# EAGLE design dual power (EAGLE 9.6.2)
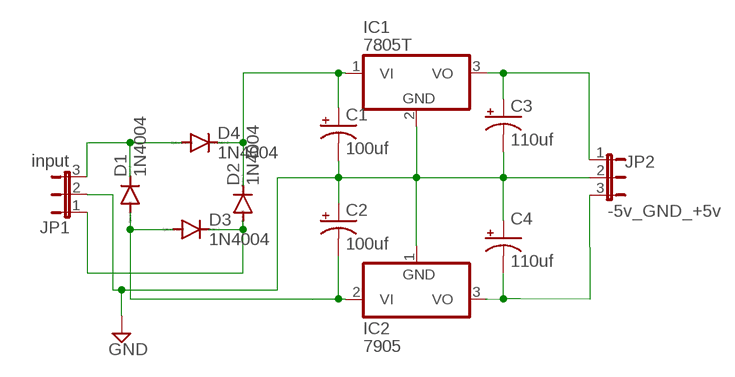
[diagram p0: schematic, sheet 1]

## Parts
C1  100uf  CPOL-US085CS-1AR  [085CS_1AR]
C2  100uf  CPOL-US085CS-1AR  [085CS_1AR]
C3  110uf  CPOL-US085CS-1AR  [085CS_1AR]
C4  110uf  CPOL-US085CS-1AR  [085CS_1AR]
D1  1N4004  [DO41-10]
D2  1N4004  [DO41-10]
D3  1N4004  [DO41-10]
D4  1N4004  [DO41-10]
IC1  7805T  [TO220H]
IC2  7905  7906T  [TO220H]
JP1  input  JP2E  [JP2]
JP2  -5v_GND_+5v  JP2E  [JP2]

## Nets
GND: C1.- C2.+ C3.- C4.+ IC1.2(GND) IC2.1(GND) JP1.2 JP2.2
N$1: D1.C D4.A JP1.3
N$2: C1.+ D2.C D4.C IC1.1(VI)
N$3: C2.- D1.A D3.A IC2.2(VI)
N$4: D2.A D3.C JP1.1
N$6: C3.+ IC1.3(VO) JP2.1
N$7: C4.- IC2.3(VO) JP2.3

## Library data of the parts
C1-C4 = rcl:CPOL-US: POLARIZED CAPACITOR, American symbol; SPICEPREFIX: C
D1-D4 = diode:1N4004: DIODE general purpose rectifier, 1 A
IC1 = linear:78*: Positive VOLTAGE REGULATOR Source: http://cache.national.com/ds/LM/LM78L05.pdf http://www.fairchildsemi.com/ds/LM/LM7805.pdf
IC2 = linear:79*: Negative VOLTAGE REGULATOR
JP1 JP2 = jumper:JP2E: JUMPER

## Board
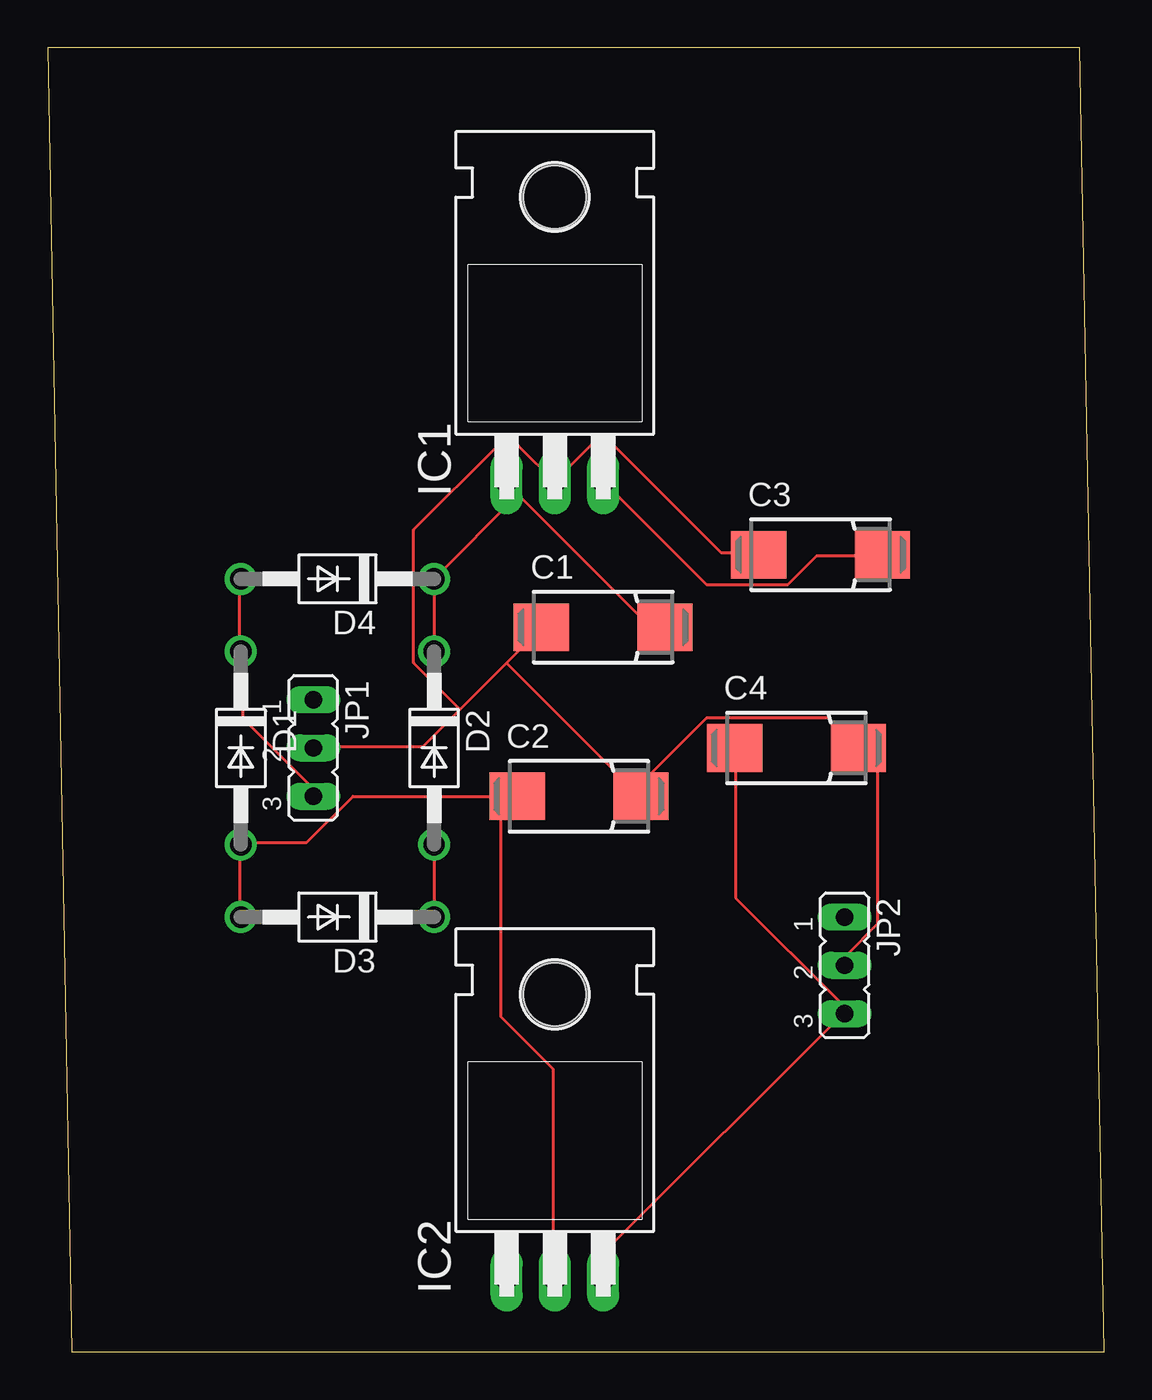
[diagram p1: board, top side]
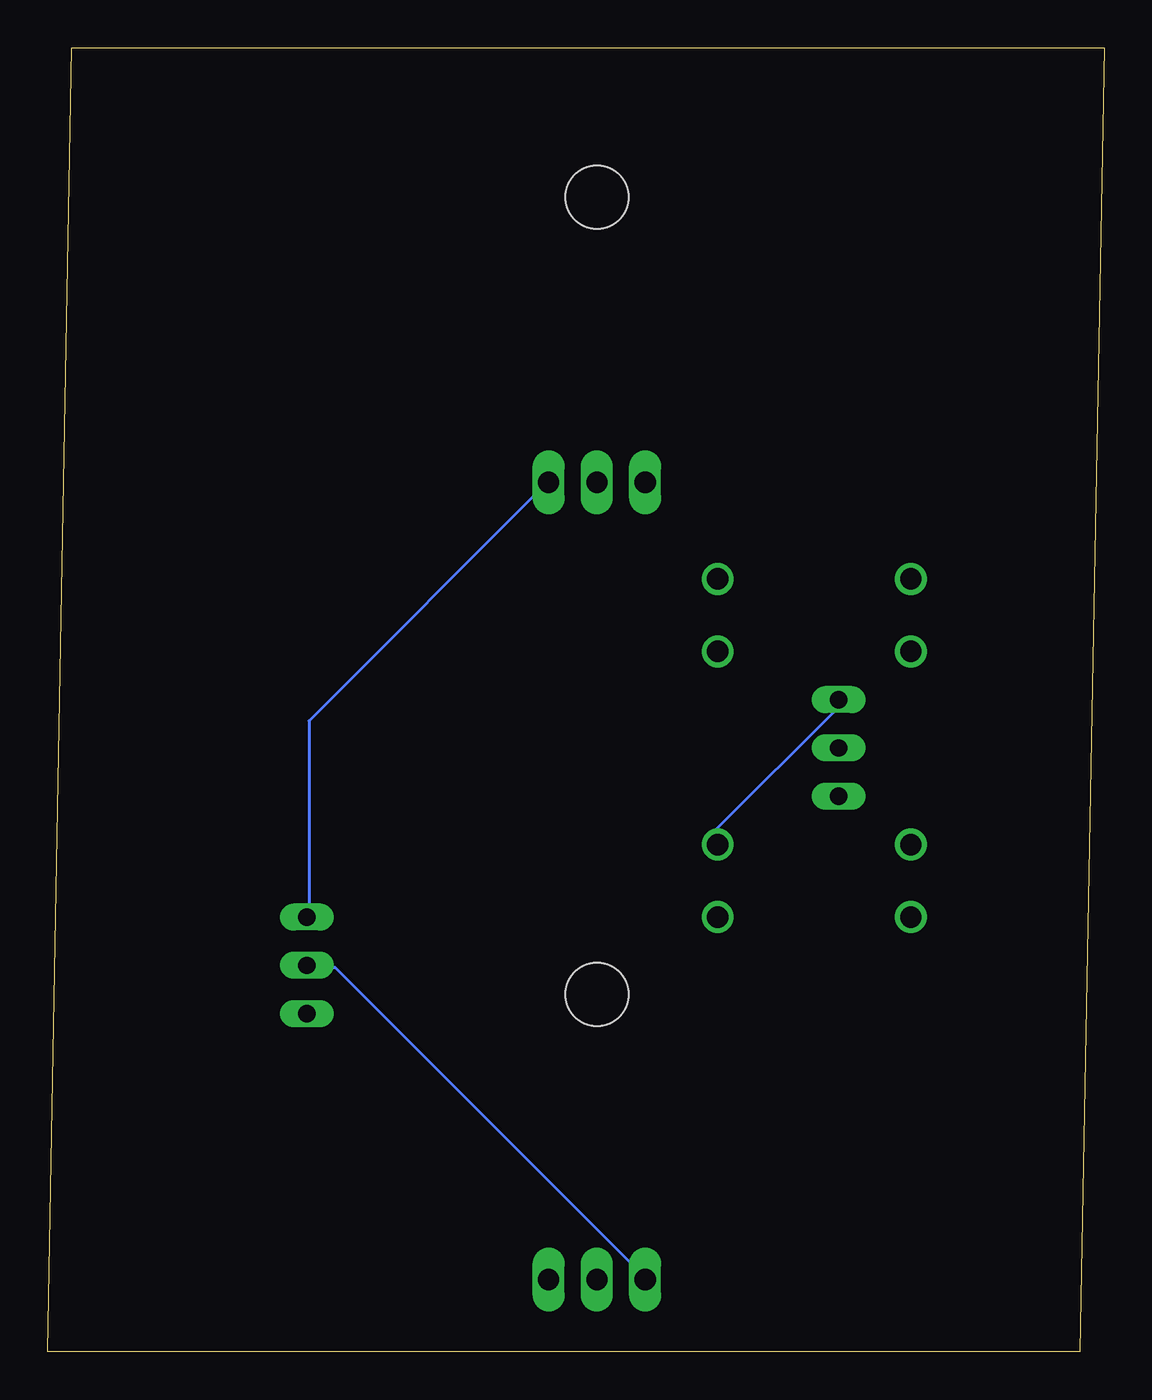
[diagram p2: board, bottom side, seen from below]

Size 55.55 x 68.57 mm. Coordinates in mm from the lower left corner, seen from the top.
Outline: 1.27,0 55.55,0 54.28,68.57 0,68.57 1.27,0
Copper layers (1*16): Top 0.035mm / dielectric 1.5mm / Bottom 0.035mm
Design rules "default": minimum track width 6mil, minimum drill 0.35mm, track to track 6mil, track to pad 6mil, pad to pad 6mil, via to via 6mil, smd to smd 6mil, copper to edge 40mil, drill to drill 6mil, minimum pad ring 10mil, minimum via ring 8mil, stop-mask expansion 4mil, vias tented up to drill 0mil, thermal gap 10mil

### Footprints (pad centres in the part's own frame; a part is rotated, then mirrored left to right if it is on the bottom)
085CS_1AR = smd 2.9 x 2.5: + 3.25,0; - -3.25,0
DO41-10 = drill 1.118: A 5.08,0; C -5.08,0
TO220H = drill 1.118 long: 1 -2.54,-10.16; 2 0,-10.16; 3 2.54,-10.16 | hole 3.302: 0,4.826
JP2 = drill 0.914 long: 1 -2.54,0; 2 0,0; 3 2.54,0

### Placement (x,y rotation side)
C1  29.21,38.1 0 top
C2  27.94,29.21 0 top
C3  40.64,41.91 0 top
C4  39.37,31.75 0 top
D1  10.16,31.75 270 top
D2  20.32,31.75 270 top
D3  15.24,22.86 180 top
D4  15.24,40.64 180 top
IC1  26.67,55.88 0 top
IC2  26.67,13.97 0 top
JP1  13.97,31.75 270 top
JP2  41.91,20.32 270 top

### Tracks (layer width: path | path; a pad name or v marks a point on that pad's centre or on a via)
GND
  Top 0.152: C3.- 37.39,42.01 35.41,42.01 29.77,47.65 28.55,47.65 26.72,45.82 IC1.2 24.74,47.65 23.67,47.65 19.25,43.23 19.25,36.22 21.69,33.78 | 24.13,36.22 25.96,38.05 C1.- | 24.13,36.22 21.69,33.78 | 21.69,33.78 19.71,31.8 14.07,31.8 JP1.2 | 24.13,36.22 30.84,29.52 | 30.84,29.52 31.14,29.21 C2.+ 30.84,29.52 | JP2.2 41.96,20.37 41.96,20.83 43.64,22.5 43.64,30.73 42.72,31.65 C4.+ 42.57,31.8 41.05,33.32 34.65,33.32 30.84,29.52
  Bottom 0.152: IC2.1 24.13,3.91 40.44,20.22 41.81,20.22 JP2.2
N$1
  Top 0.152: JP1.3 13.92,29.21 13.92,29.67 10.26,33.32 10.26,36.83 D1.C 10.11,36.83 10.11,40.64 D4.A
N$2
  Top 0.152: D2.C D4.C 24.74,45.06 | 24.74,45.06 24.13,45.67 IC1.1 24.74,45.06 | 24.74,45.06 31.6,38.2 32.36,38.2 C1.+
N$3
  Top 0.152: 23.83,29.21 16.05,29.21 13.61,26.77 10.26,26.77 D1.A 10.11,26.62 10.11,22.96 D3.A | 23.83,29.21 C2.- | 23.83,29.21 23.83,17.63 26.57,14.88 26.57,3.91 IC2.2
N$4
  Top 0.152: D2.A D3.C
  Bottom 0.152: D2.A 20.32,27.53 14.07,33.78 14.07,34.24 JP1.1
N$6
  Top 0.152: C3.+ 43.79,41.86 40.44,41.86 38.91,40.33 34.65,40.33 29.31,45.67 IC1.3
  Bottom 0.152: JP2.1 41.81,22.96 41.81,33.17 29.31,45.67 IC1.3
N$7
  Top 0.152: 41.81,17.78 41.81,18.24 36.17,23.88 36.17,31.65 C4.- | 41.81,17.78 29.31,5.28 29.31,3.91 IC2.3 | 41.81,17.78 JP2.3